# Altium schematic sheet AuxiliaryBoard.SchDoc
size C; SheetNumber: 1; SheetTotal: 1
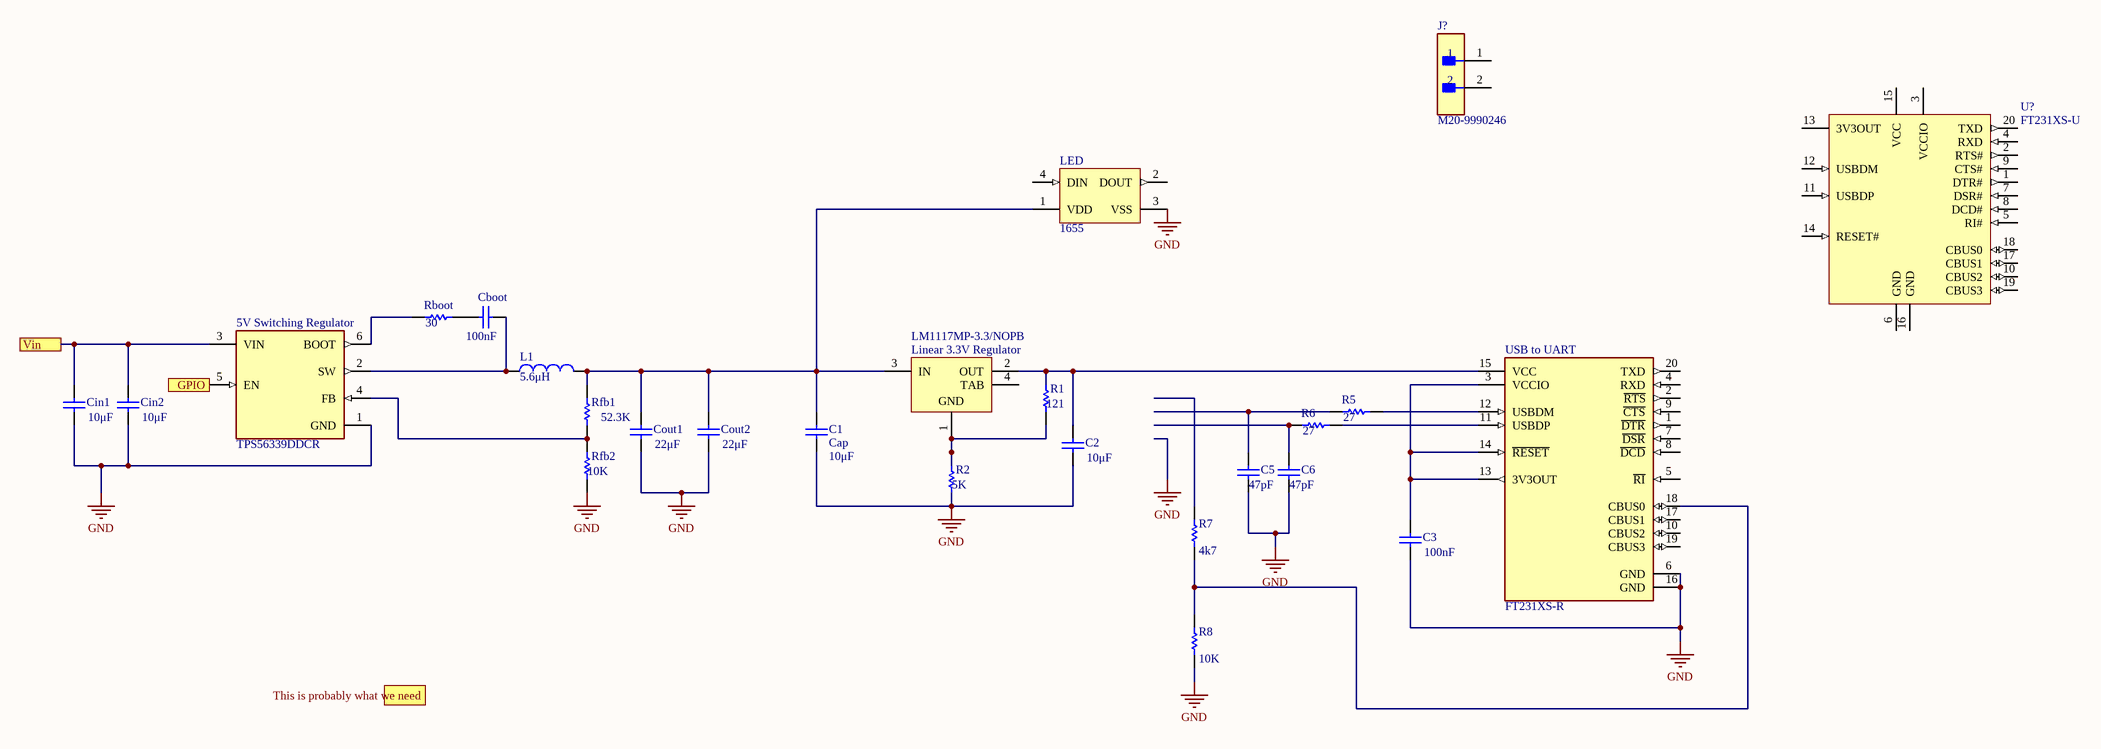
[diagram p0: AuxiliaryBoard.SchDoc]

## Parts
5V_Switching_Regulator  TPS56339DDCR  [FP-DDC0006A-MFG]
C1  Cap  value 10μF  [RAD-0.3]
C2  value 10μF  [RAD-0.3]
C3  value 100nF  [RAD-0.3]
C5  value 47pF  [RAD-0.3]
C6  value 47pF  [RAD-0.3]
Cboot  value 100nF  [RAD-0.3]
Cin1  value 10μF  [RAD-0.3]
Cin2  value 10μF  [RAD-0.3]
Cout1  value 22μF  [RAD-0.3]
Cout2  value 22μF  [RAD-0.3]
J?  M20-9990246  [FP-M20-9990246-MFG]
L1  value 5.6μH  [0402-A]
LED  1655  [ADA-RGB-1655_V]
Linear_3.3V_Regulator  LM1117MP-3.3/NOPB  [DCY0004A_L]
R1  value 121  [AXIAL-0.3]
R2  value 5K  [AXIAL-0.3]
R5  value 27  [AXIAL-0.3]
R6  value 27  [AXIAL-0.3]
R7  value 4k7  [AXIAL-0.3]
R8  value 10K  [AXIAL-0.3]
Rboot  value 30  [AXIAL-0.3]
Rfb1  value 52.3K  [AXIAL-0.3]
Rfb2  value 10K  [AXIAL-0.3]
U?  FT231XS-U  [SSOP-20_L]
USB_to_UART  FT231XS-R  [FP-SSOP-20-MFG]

## Ports
GPIO, This is probably what we need, Vin

## Nets
GND: 5V_Switching_Regulator.1(GND) C1.1 C2.1 C3.1 C5.1 C6.1 Cin1.1 Cin2.1 Cout1.1 Cout2.1 LED.3(VSS) R2.1 R8.1 Rfb2.1 USB_to_UART.6(GND) USB_to_UART.16(GND)
GPIO: 5V_Switching_Regulator.5(EN) ; port GPIO
Vin: 5V_Switching_Regulator.3(VIN) Cin1.2 Cin2.2 ; port Vin
Net5V_Switching_Regulator_2: 5V_Switching_Regulator.2(SW) Cboot.2 L1.1
Net5V_Switching_Regulator_4: 5V_Switching_Regulator.4(FB) Rfb1.2 Rfb2.2
Net5V_Switching_Regulator_6: 5V_Switching_Regulator.6(BOOT) Rboot.1
NetC1_2: C1.2 Cout1.2 Cout2.2 L1.2 LED.1(VDD) Linear_3.3V_Regulator.3(IN) Rfb1.1
NetC2_2: C2.2 Linear_3.3V_Regulator.2(OUT) R1.2 USB_to_UART.15(VCC)
NetC3_2: C3.2 USB_to_UART.3(VCCIO) USB_to_UART.13(3V3OUT) USB_to_UART.14(~{RESET})
NetC5_2: C5.2 R5.1
NetC6_2: C6.2 R6.1
NetCboot_1: Cboot.1 Rboot.2
NetLinear_3.3V_Regulator_1: Linear_3.3V_Regulator.1(GND) R1.1 R2.2
NetR5_2: R5.2 USB_to_UART.12(USBDM)
NetR6_2: R6.2 USB_to_UART.11(USBDP)
NetR7_1: R7.1 R8.2 USB_to_UART.18(CBUS0)

Not connected (* = marked no-connect by the designer): J? 1 2; LED 2(DOUT) 4(DIN); Linear_3.3V_Regulator 4(TAB); R7 2; U? 1(DTR#) 2(RTS#) 3(VCCIO) 4(RXD) 5(RI#) 6(GND) 7(DSR#) 8(DCD#) 9(CTS#) 10(CBUS2) 11(USBDP) 12(USBDM) 13(3V3OUT) 14(RESET#) 15(VCC) 16(GND) 17(CBUS1) 18(CBUS0) 19(CBUS3) 20(TXD); USB_to_UART 1(~{DTR}) 2(~{RTS}) 4(RXD) 5(~{RI}) 7(~{DSR}) 8(~{DCD}) 9(~{CTS}) 10(CBUS2) 17(CBUS1) 19(CBUS3) 20(TXD)

## Library data of the parts
5V_Switching_Regulator = CMP-04918-000012-1: PWR MGMT SPECIALIZED REGULATOR; Manufacturer: Texas Instruments; Output Type: AdjustableProgrammable; Max Supply Voltage: 24V; Min Supply Voltage: 4.5V; Nominal Supply Current: 98uA; Max Duty Cycle: 97%; Number Of Outputs: 1; Output Current: 3A; Switching Topology: Buck; Standoff Height: 0mm; Switching Frequency: 500kHz; Output Voltage: 0.8-16V; Max Junction Temp: +125°C; ComponentLink2Description: Datasheet; ComponentLink2URL: http://www.ti.com/lit/ds/symlink/tps56339.pdf; Package: DDC0006A; RoHS: TRUE; Temperature: -40°C to +125°C; Temperature Range Low: -40°C; Device Class L3: Voltage Regulators - Switching; Temperature Range High: +125°C; Device Class L2: Power Management ICs; Device Class L1: Integrated Circuits (ICs); Category: IC; Manufacturer Part Number: TPS56339DDCR; Octopart: https://octopart.com/tps56339ddcr-texas+instruments-101466410; Automotive: No; Height: 1.1mm; Digikey Description: PWR MGMT SPECIALIZED REGULATOR; Lead Free: Yes; Mouser Description: 4.5-V to 24-V input, 3-A output synchronous buck converter 6-SOT-23-THIN -40 to 125
C1-C3 C5 C6 Cboot Cin1 Cin2 Cout1 Cout2 = Cap: Capacitor; Published: 8-Jun-2000; LatestRevisionDate: 17-Jul-2002; LatestRevisionNote: Re-released for DXP Platform.; PackageReference: RAD-0.3; Publisher: Altium Limited; PackageDescription: Radial Cap, Thru-Hole; 2 Leads; 0.3 in Pin Spacing
J? = CMP-15831-000009-1: CONN HEADER VERT 2POS 2.54MM; Manufacturer: Harwin; Conn Gender: Male; Conn Orientation: Vertical; Number Of Contacts: 2; Current Rating: 3A; ComponentLink2URL: https://cdn.harwin.com/pdfs/M20-999.pdf; ComponentLink2Description: Datasheet; Package: M20-9990246; Temperature: -40°C to +105°C; Octopart: https://octopart.com/m20-9990246-harwin-2590635; Mouser Description: 2.54mm (0.1") Pitch SIL Vertical PC Tail Pin Header, 6.1mm mating pin height, tin, 2 contacts; Temperature Range High: +105°C; Device Class L1: Connectors; RoHS: TRUE; Automotive: No; Height: 8.99mm; Number Of Rows: 1; Contact Material: Tin,Nickel; Category: Conn; Pitch: 2.54mm; Lead Free: Yes; Digikey Description: CONN HEADER VERT 2POS 2.54MM; Manufacturer Part Number: M20-9990246; Temperature Range Low: -40°C; Device Class L3: unset; Device Class L2: Headers and Wire Housings
L1 = Inductor: Code_IEC: 1005; Published: 8-Jun-2000; LatestRevisionDate: 29-May-2009; LatestRevisionNote: IPC-7351 Footprint Added.; PackageReference: 0402-A; Publisher: Altium Limited; PackageDescription: Chip Inductor; Code_JEITA: 0402
LED = CMP-2000-05026-1: Intelligent Control LED Integrated Light Source, 3.5 to 5.3 V, -25 to 80 degC, 4-Pin SMD, RoHS, Tape and Reel; Manufacturer: Adafruit-Industries-LLC; Number of LEDs: 10; Configuration: Discrete; Utilized LED: WS2812(5050); Datasheet URL: http://datasheet.octopart.com/ADA1655-Adafruit-Industries-datasheet-32028139.pdf; Series: Neopixel; Interface: -; Package Description: 4-Pin Surface Mount Device, Body 5 x 5 mm; Color: Red,Green,Blue(RGB); Category: Optoelectronics; Controller Type: -; Package Reference: 1655; Manufacturer URL: https://www.adafruit.com/; Mounting Type: SurfaceMount; Datasheet Version: May-13; Size / Dimension: 5.00mmLx5.00mmW; Family: Addressable,Specialty
Linear_3.3V_Regulator = CMP-0062-01638-4: 800mA Low-Dropout Linear Regulator, 4-pin SOT-223, Pb-Free; Manufacturer: Texas Instruments; CompType: LDO IC; PackageTopMarking: XYTT*N05A; High-Reliability: Y; PowerWise: N; ComponentLink1URL: http://www.ti.com/general/docs/lit/getliterature.tsp?genericPartNumber=LM1117-N&fileType=pdf; PinCount: 4; PackageDescription: Molded SOT-223, 6.50 x 3.56 x 1.6mm Body, 4 Lead, 2.3mm Pitch; Code_IPC: SOT223-4; PartNumber: LM1117MP-3.3/NOPB; Code_JEDEC: TO-261-AA; RoHS: Y; PackageReference: DCY0004A; ComponentLink1Description: Datasheet URL
R1 R2 R5-R8 Rboot Rfb1 Rfb2 = Res1: Resistor; Published: 8-Jun-2000; LatestRevisionDate: 17-Jul-2002; LatestRevisionNote: Re-released for DXP Platform.; PackageReference: AXIAL-0.3; Publisher: Altium Limited; PackageDescription: Axial Device, Thru-Hole; 2 Leads; 0.3 in Pin Spacing
U? = CMP-0248-00015-2: USB to Full-Handshake UART Interface Chip, UHCI/OHCI/EHCI Compatible, USB 2.0 Compatible, -40 to +85 degC, 20-Pin SSOP, Pb-Free, Tube; Manufacturer: FTDI; PackageDescription: 20-Pin Small Outline Package, 8.6 x 3.9 mm Body, 0.635 mm Pitch; ComponentLink2Description: Datasheet; DatasheetVersion: ver 1.2, Feb-2013; PackageReference: SSOP-20; ComponentLink3URL: www.ftdichip.com/Products/ICs/FT231X.html; ComponentLink2URL: http://www.ftdichip.com/Support/Documents/DataSheets/ICs/DS_FT231X.pdf; PartNumber: FT231XS-U; ComponentLink3Description: FT231X Product Page; ComponentLink1URL: http://www.ftdichip.com/; Code_JEDEC: MO-137-AD; ComponentLink1Description: Manufacturer URL; RevisionNote: DatasheetVersion updated to 1.2 Feb-2013; PackageVersion: Feb-13
USB_to_UART = CMP-0248-00024-3: IC USB SERIAL FULL UART 20SSOP; Operating Supply Voltage: 5V; Operating Supply Current: 8mA; Number of Channels: 1; Min Supply Voltage: 2.97V; Max Supply Voltage: 5.5V; Data Rate: 12Mbps; Height: 0.059inch; Packaging: Tape and Reel; Mount: Surface Mount; Package Quantity: 2000; Radiation Hardening: No; Case/Package: SSOP; Min Operating Temperature: -40°C; Width: 0.157inch; Number of Pins: 20; Weight: 0.016oz; Interface: UART; Max Operating Temperature: 85°C; Length: 8.74mm